# EAGLE design uDuino (EAGLE 8.2.1)
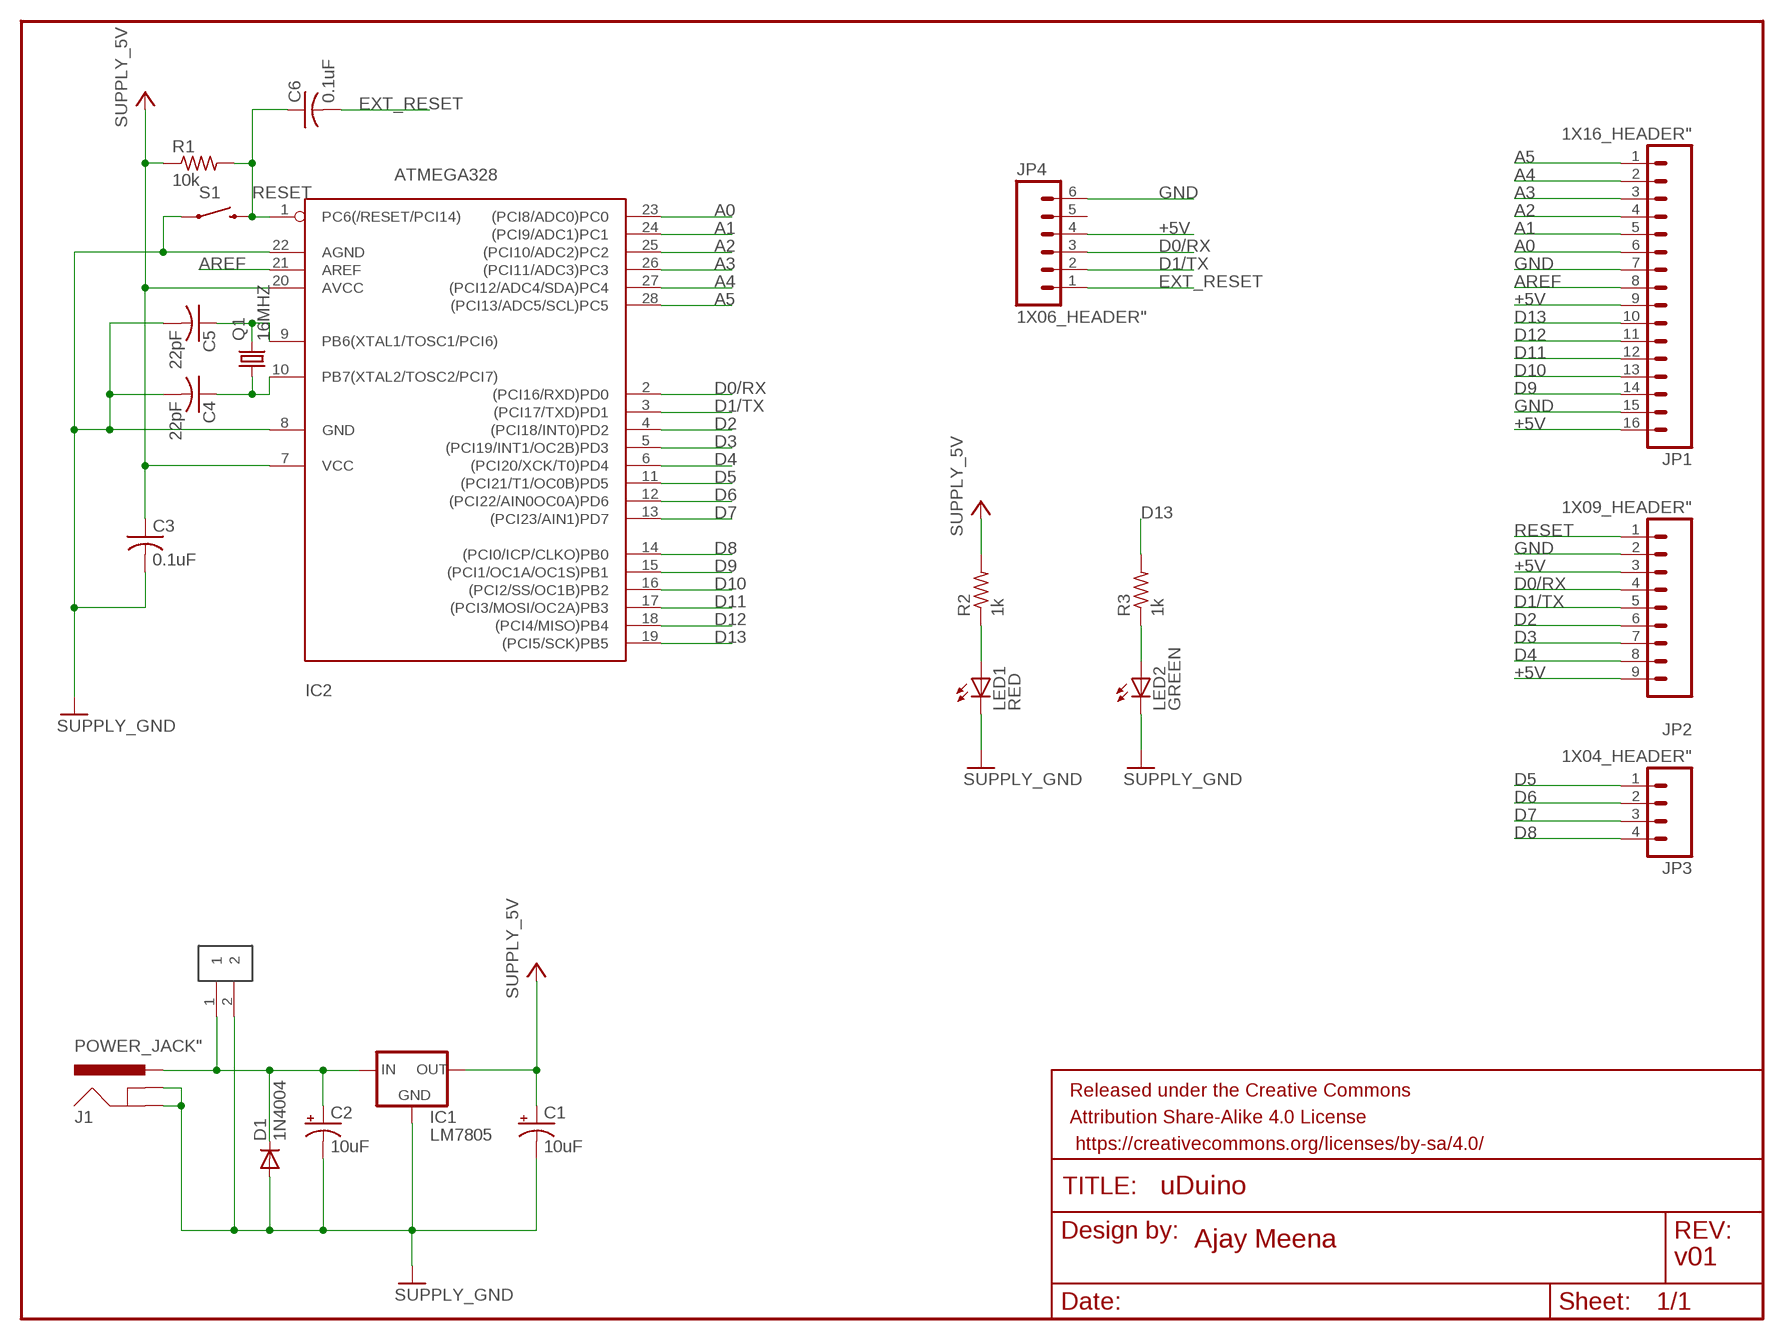
[diagram p0: schematic, sheet 1]

## Parts
C1  10uF  ELECTROLYTIC_CAP2.54MM  [ELECTROLYTIC_CAP]
C2  10uF  ELECTROLYTIC_CAP2.54MM  [ELECTROLYTIC_CAP]
C3  0.1uF  UNPOLARIZED_CAP"  [UNPOLARIZED_CAP]
C4  22pF  UNPOLARIZED_CAP"  [UNPOLARIZED_CAP]
C5  22pF  UNPOLARIZED_CAP"  [UNPOLARIZED_CAP]
C6  0.1uF  UNPOLARIZED_CAP"  [UNPOLARIZED_CAP]
D1  1N4004  [DO41-10]
FRAME1  FRAME-LETTERNO_PACKAGE  [DUMMY]
IC1  LM7805  REGULATOR  [L4931_REGULATOR]
IC2  ATMEGA328  ATMEGA328"  [ATMEGA328]
J1  POWER_JACK"  [POWER_JACK]
JP1  1X16_HEADER"  [1X16_HEADER]
JP2  1X09_HEADER"  [1X09_HEADER]
JP3  1X04_HEADER"  [1X04_HEADER]
JP4  1X06_HEADER"  [1X06_HEADER]
JP5  1X02_HEADER  [1X02_HEADER]
LED1  RED  LED5MM  [LED5MM]
LED2  GREEN  LED5MM  [LED5MM]
Q1  16MHZ  CRYSTALHC49S  [HC49/S]
R1  10k  R-US_0204/7  [0204/7]
R2  1k  R-US_0204/7  [0204/7]
R3  1k  R-US_0204/7  [0204/7]
S1  MOMENTARY_SWITCH"  [MOMENTARY_SWITCH]

## Nets
+5V: C1.+ C3.1 IC1.OUT IC2.7(VCC) IC2.20(AVCC) JP1.9 JP1.16 JP2.3 JP2.9 JP4.4 R1.1 R2.2 ; supply symbol labelled SUPPLY_5V
A0: IC2.23((PCI8/ADC0)PC0) JP1.6
A1: IC2.24((PCI9/ADC1)PC1) JP1.5
A2: IC2.25((PCI10/ADC2)PC2) JP1.4
A3: IC2.26((PCI11/ADC3)PC3) JP1.3
A4: IC2.27((PCI12/ADC4/SDA)PC4) JP1.2
A5: IC2.28((PCI13/ADC5/SCL)PC5) JP1.1
AREF: IC2.21(AREF) JP1.8
D0/RX: IC2.2((PCI16/RXD)PD0) JP2.4 JP4.3
D1/TX: IC2.3((PCI17/TXD)PD1) JP2.5 JP4.2
D2: IC2.4((PCI18/INT0)PD2) JP2.6
D3: IC2.5((PCI19/INT1/OC2B)PD3) JP2.7
D4: IC2.6((PCI20/XCK/T0)PD4) JP2.8
D5: IC2.11((PCI21/T1/OC0B)PD5) JP3.1
D6: IC2.12((PCI22/AIN0OC0A)PD6) JP3.2
D7: IC2.13((PCI23/AIN1)PD7) JP3.3
D8: IC2.14((PCI0/ICP/CLKO)PB0) JP3.4
D9: IC2.15((PCI1/OC1A/OC1S)PB1) JP1.14
D10: IC2.16((PCI2/SS/OC1B)PB2) JP1.13
D11: IC2.17((PCI3/MOSI/OC2A)PB3) JP1.12
D12: IC2.18((PCI4/MISO)PB4) JP1.11
D13: IC2.19((PCI5/SCK)PB5) JP1.10 R3.2
EXT_RESET: C6.2 JP4.1
GND: C1.- C2.- C3.2 C4.2 C5.2 D1.A IC1.GND IC2.8(GND) IC2.22(AGND) J1.GND J1.GNDBREAK JP1.7 JP1.15 JP2.2 JP4.6 JP5.2 LED1.K(C) LED2.K(C) S1.1 ; supply symbol labelled SUPPLY_GND
N$1: C2.+ D1.C IC1.IN J1.PWR JP5.1
N$2: C5.1 IC2.9(PB6(XTAL1/TOSC1/PCI6)) Q1.2
N$3: C4.1 IC2.10(PB7(XTAL2/TOSC2/PCI7)) Q1.1
N$4: LED2.A R3.1
N$5: LED1.A R2.1
RESET: C6.1 IC2.1(PC6(/RESET/PCI14)) JP2.1 R1.2 S1.3
Unconnected: JP4.5

## Library data of the parts
C1 C2 = RBBB:ELECTROLYTIC_CAP: POLARIZED CAPACITOR, American symbol
C3-C6 = RBBB:UNPOLARIZED_CAP: CAPACITOR, American symbol
D1 = adafruit:1N4004: DIODE General purpose 1N400x type rectifier (With bigger pads) http://www.ladyada.net/library/pcb/eaglelibrary.html
FRAME1 = SparkFun-Aesthetics:FRAME-LETTER: Schematic Frame - Letter Standard 8.5x11 US Letter frame; DESIGNER: Ajay Meena; VERSION: v01
IC1 = RBBB:REGULATOR: VOLTAGE REGULATOR
IC2 = RBBB:ATMEGA328: MICROCONTROLLER 16 kBytes FLASH 1 kBytes SRAM 512 Bytes EEPROM USART 8-channel 10 bit ADC
J1 = RBBB:POWER_JACK: Power Jack This is the standard 5.5mm barrel jack for power. The PTH is the most common, proven, reliable, footprint. All others are experimental. The Slot footprint only works if the mill layer is transmitted to the PCB fab house so be warned. Spark Fun Electronics SKU : PRT-00119. Mating wall wart : TOL-00298 (and others)
JP1 = RBBB:1X16_HEADER
JP2 = RBBB:1X09_HEADER: Header 9 Standard 9-pin 0.1" header. Use with straight break away headers (SKU : PRT-00116), right angle break away headers (PRT-00553), swiss pins (PRT-00743), machine pins (PRT-00117), and female headers (PRT-00115).
JP3 = RBBB:1X04_HEADER: Header 4 Standard 4-pin 0.1" header. Use with straight break away headers (SKU : PRT-00116), right angle break away headers (PRT-00553), swiss pins (PRT-00743), machine pins (PRT-00117), and female headers (PRT-00115). Molex polarized connector foot print use with SKU : PRT-08231 with associated crimp pins and housings.
JP4 = RBBB:1X06_HEADER
JP5 = RBBB:1X02_HEADER
LED1 LED2 = adafruit:LED: LED OSRAM: - CHIPLED LG R971, LG N971, LY N971, LG Q971, LY Q971, LO R971, LY R971 LH N974, LH R974 LS Q976, LO Q976, LY Q976 LO Q996 - Hyper CHIPLED LW Q18S LB Q993, LB Q99A, LB R99A - SideLED LS A670, LO A670, LY A670, LG A670, LP A670 LB A673, LV A673, LT A673, LW A673 LH A674 LY A675 LS A676, LA A676, LO A676, LY A676, LW A676 LS A679, LY A679, LG A679 - Hyper Micro SIDELED® LS Y876, LA Y876, LO Y876, LY Y876 LT Y87S - SmartLED LW L88C, LW L88S LB L89C, LB L89S, LG L890 LS L89K, LO L89K, LY L89K LS L896, LA L896, LO L896, LY L896 - TOPLED LS T670, LO T670, LY T670, LG T670, LP T670 LSG T670, LSP T670, LSY T670, LOP T670, LYG T670 LG T671, LOG T671, LSG T671 LB T673, LV T673, LT T673, LW T673 LH T674 LS T676, LA T676, LO T676, LY T676, LB T676, LH T676, LSB T676, LW T676 LB T67C, LV T67C, LT T67C, LS T67K, LO T67K, LY T67K, LW E67C LS E67B, LA E67B, LO E67B, LY E67B, LB E67C, LV E67C, LT E67C LW T67C LS T679, LY T679, LG T679 LS T770, LO T770, LY T770, LG T770, LP T770 LB T773, LV T773, LT T773, LW T773 LH T774 LS E675, LA E675, LY E675, LS T675 LS T776, LA T776, LO T776, LY T776, LB T776 LHGB T686 LT T68C, LB T68C - Hyper Mini TOPLED® LB M676 - Mini TOPLED Santana® LG M470 LS M47K, LO M47K, LY M47K Source: http://www.osram.convergy.de/
Q1 = adafruit:CRYSTAL: CRYSTAL; OC_FARNELL: 1667008; OC_NEWARK: unknown
R1-R3 = adafruit:R-US_: RESISTOR, American symbol
S1 = RBBB:MOMENTARY_SWITCH

## Board
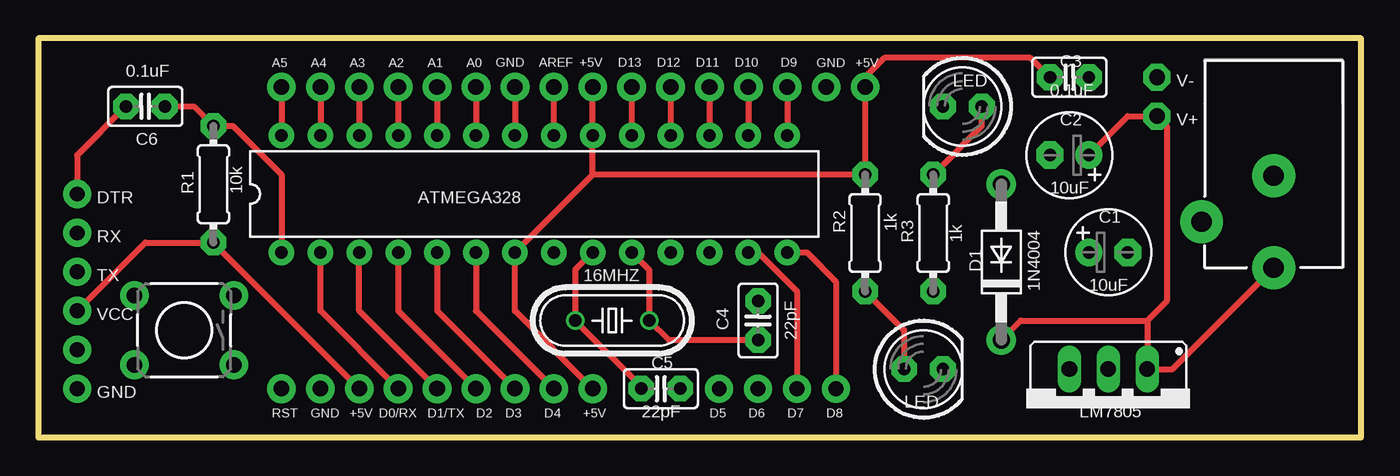
[diagram p1: board, top side]
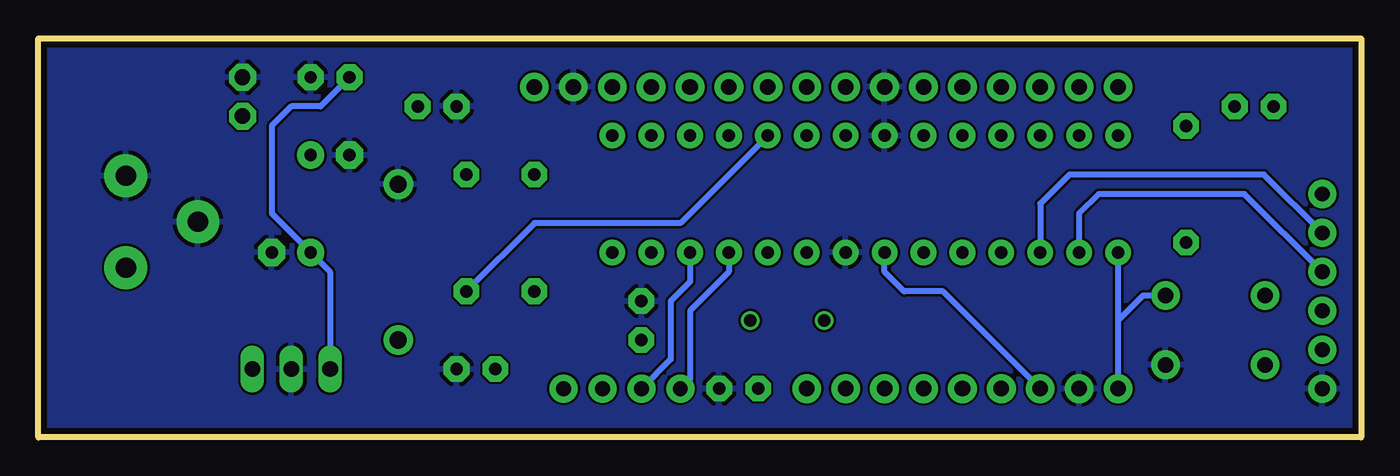
[diagram p2: board, bottom side, seen from below]

Size 86.36 x 26.04 mm. Coordinates in mm from the lower left corner, seen from the top.
Outline: 0,0 86.36,0 86.36,26.04 0,26.04 0,0
Copper layers (1*16): Top 0.0356mm / dielectric 1.5011mm / Bottom 0.0356mm
Design rules "LaenPCBOrder": minimum track width 6mil, minimum drill 13mil, track to track 6mil, track to pad 6mil, pad to pad 6mil, via to via 6mil, smd to smd 6mil, copper to edge 15mil, drill to drill 6mil, minimum pad ring 7mil, minimum via ring 7mil, stop-mask expansion 3mil, vias tented up to drill 0mil, thermal gap 10mil

### Footprints (pad centres in the part's own frame; a part is rotated, then mirrored left to right if it is on the bottom)
ELECTROLYTIC_CAP = drill 0.813 pad 1.778: + -1.27,0 | drill 0.813 pad 1.778 octagon: - 1.27,0
UNPOLARIZED_CAP = drill 0.813 pad 1.676 octagon: 1 -1.27,0; 2 1.27,0
DO41-10 = drill 1.118 pad 1.93: A 5.08,0; C -5.08,0
L4931_REGULATOR = drill 1.016 long: GND 0,-2.54; IN -2.54,-2.54; OUT 2.54,-2.54
ATMEGA328 = drill 0.813 pad 1.676: 1 -16.51,-3.81; 2 -13.97,-3.81; 3 -11.43,-3.81; 4 -8.89,-3.81; 5 -6.35,-3.81; 6 -3.81,-3.81; 7 -1.27,-3.81; 8 1.27,-3.81; 9 3.81,-3.81; 10 6.35,-3.81; 11 8.89,-3.81; 12 11.43,-3.81; 13 13.97,-3.81; 14 16.51,-3.81; 15 16.51,3.81; 16 13.97,3.81; 17 11.43,3.81; 18 8.89,3.81; 19 6.35,3.81; 20 3.81,3.81; 21 1.27,3.81; 22 -1.27,3.81; 23 -3.81,3.81; 24 -6.35,3.81; 25 -8.89,3.81; 26 -11.43,3.81; 27 -13.97,3.81; 28 -16.51,3.81
POWER_JACK = drill 1.321 pad 2.794: GND 0,7.7; GNDBREAK 4.7,10.7; PWR 0,13.7
1X16_HEADER = drill 1.016 pad 1.88: 1 0,0; 2 2.54,0; 3 5.08,0; 4 7.62,0; 5 10.16,0; 6 12.7,0; 7 15.24,0; 8 17.78,0; 9 20.32,0; 10 22.86,0; 11 25.4,0; 12 27.94,0; 13 30.48,0; 14 33.02,0; 15 35.56,0; 16 38.1,0
1X09_HEADER = drill 1.016 pad 1.88: 1 0,0; 2 2.54,0; 3 5.08,0; 4 7.62,0; 5 10.16,0; 6 12.7,0; 7 15.24,0; 8 17.78,0; 9 20.32,0
1X04_HEADER = drill 0.965 pad 1.829: 1 0,0; 2 2.54,0; 3 5.08,0; 4 7.62,0
1X06_HEADER = drill 0.965 pad 1.829: 1 0,0; 2 2.54,0; 3 5.08,0; 4 7.62,0; 5 10.16,0; 6 12.7,0
1X02_HEADER = drill 1.016 pad 1.778 octagon: 1 -1.27,0; 2 1.27,0
LED5MM = drill 0.813 pad 1.676 octagon: A -1.27,0; K 1.27,0
HC49/S = drill 0.813: 1 -2.413,0; 2 2.413,0
0204/7 = drill 0.813 pad 1.676 octagon: 1 -3.81,0; 2 3.81,0
MOMENTARY_SWITCH = drill 1.016 pad 1.88: 1 -3.251,2.261; 2 3.251,2.261; 3 -3.251,-2.261; 4 3.251,-2.261

### Placement (x,y rotation side)
C1  69.85,12.06 0 top
C2  67.31,18.41 180 top
C3  67.31,23.5 0 top
C4  46.99,7.62 90 top
C5  40.64,3.17 0 top
C6  6.99,21.59 180 top
D1  62.87,11.43 90 top
FRAME1  0,0 0 top
IC1  69.85,1.91 180 top
IC2  32.38,15.88 0 top
J1  80.64,24.77 180 top
JP1  15.88,22.86 0 top
JP2  15.88,3.17 0 top
JP3  44.45,3.17 0 top
JP4  2.54,15.88 270 top
JP5  73.03,22.23 90 top
LED1  57.78,4.45 0 top
LED2  60.33,21.59 180 top
Q1  37.47,7.62 180 top
R1  11.43,16.51 90 top
R2  53.98,13.34 90 top
R3  58.42,13.34 270 top
S1  9.53,6.99 180 top

### Tracks (layer width: path | path; a pad name or v marks a point on that pad's centre or on a via)
+5V
  Top 0.406: JP1.9 IC2.20 36.2,17.14 | JP2.9 31.11,8.26 IC2.7 36.2,17.14 | JP2.3 R1.1 6.99,12.7 JP4.4 | C3.1 64.77,24.77 55.24,24.77 53.98,23.5 JP1.16 R2.2 36.2,17.14
  Bottom 0.406: IC1.OUT 67.31,10.79 C1.+ 71.12,14.61 71.12,20.32 69.85,21.59 67.94,21.59 C3.1 | JP2.3 27.3,9.53 29.84,9.53 31.11,10.79 IC2.7
A0
  Top 0.406: JP1.6 IC2.23
A1
  Top 0.406: JP1.5 IC2.24
A2
  Top 0.406: JP1.4 IC2.25
A3
  Top 0.406: JP1.3 IC2.26
A4
  Top 0.406: JP1.2 IC2.27
A5
  Top 0.406: JP1.1 IC2.28
AREF
  Top 0.406: IC2.21 JP1.8
D0/RX
  Top 0.406: IC2.2 18.41,8.26 JP2.4
  Bottom 0.406: JP4.3 7.62,15.88 17.14,15.88 18.41,14.61 IC2.2
D1/TX
  Top 0.406: IC2.3 20.95,8.26 JP2.5
  Bottom 0.406: JP4.2 6.35,17.14 19.05,17.14 20.95,15.24 IC2.3
D2
  Top 0.406: IC2.4 23.5,8.26 JP2.6
D3
  Top 0.406: IC2.5 26.04,8.26 JP2.7
D4
  Top 0.406: IC2.6 28.57,8.26 JP2.8
D5
  Bottom 0.406: IC2.11 41.27,10.79 43.81,8.26 43.81,3.81 JP3.1
D6
  Bottom 0.406: IC2.12 43.81,10.16 45.09,8.89 45.09,5.08 JP3.2
D7
  Top 0.406: IC2.13 46.99,12.06 49.53,9.53 JP3.3
D8
  Top 0.406: IC2.14 50.16,12.06 52.07,10.16 JP3.4
D9
  Top 0.406: JP1.14 IC2.15
D10
  Top 0.406: JP1.13 IC2.16
D11
  Top 0.406: JP1.12 IC2.17
D12
  Top 0.406: JP1.11 IC2.18
D13
  Top 0.406: JP1.10 IC2.19
  Bottom 0.406: IC2.19 44.45,13.97 53.98,13.97 R3.2
EXT_RESET
  Top 0.406: C6.2 2.54,18.41 JP4.1
GND
  Top 0.406: JP1.7 IC2.22
  Bottom 0.406: 41.91,3.81 C5.2
  pour Bottom: 0.64,25.4 85.72,25.4 85.72,0.64 0.64,0.64
N$1
  Top 0.406: J1.PWR 74.03,4.45 IC1.IN 72.39,7.62 | 72.39,7.62 73.66,8.89 73.66,20.32 JP5.1 71.12,20.95 C2.+ | D1.C 64.14,7.62 72.39,7.62
N$2
  Top 0.406: IC2.9 35.05,10.92 Q1.2 39.37,3.3 C5.1
N$3
  Top 0.406: IC2.10 39.88,10.92 Q1.1 41.15,6.35 C4.1
N$4
  Top 0.406: R3.1 61.59,20.32 LED2.A
N$5
  Top 0.406: R2.1 56.52,6.99 LED1.A
RESET
  Top 0.406: C6.1 10.16,21.59 R1.2 12.7,20.32 15.88,17.14 IC2.1
  Bottom 0.406: IC2.1 15.88,7.62 | 15.88,7.62 JP2.1 | S1.3 14.25,9.25 15.88,7.62

### Text on the board
tPlace: GND | AREF | +5V | D13 | D12 | D11 | D10 | D9 | A5 | A4 | A3 | A2 | A1 | A0 | GND | +5V | C3 | 0.1uF | LED | V- | 0.1uF | C2 | V+ | C6 | R1 | 10k | 10uF | DTR | ATMEGA328 | 1k | C1 | RX | R2 | R3 | 1k | D1 | TX | 16MHZ | 1N4004 | 10uF | VCC | C4 | 22pF | C5 | GND | LED | RST | GND | +5V | D0/RX | D1/TX | D2 | D3 | D4 | +5V | 22pF | D5 | D6 | D7 | D8 | LM7805